# EAGLE schematic Meter Sequencer (EAGLE 9.0.0)
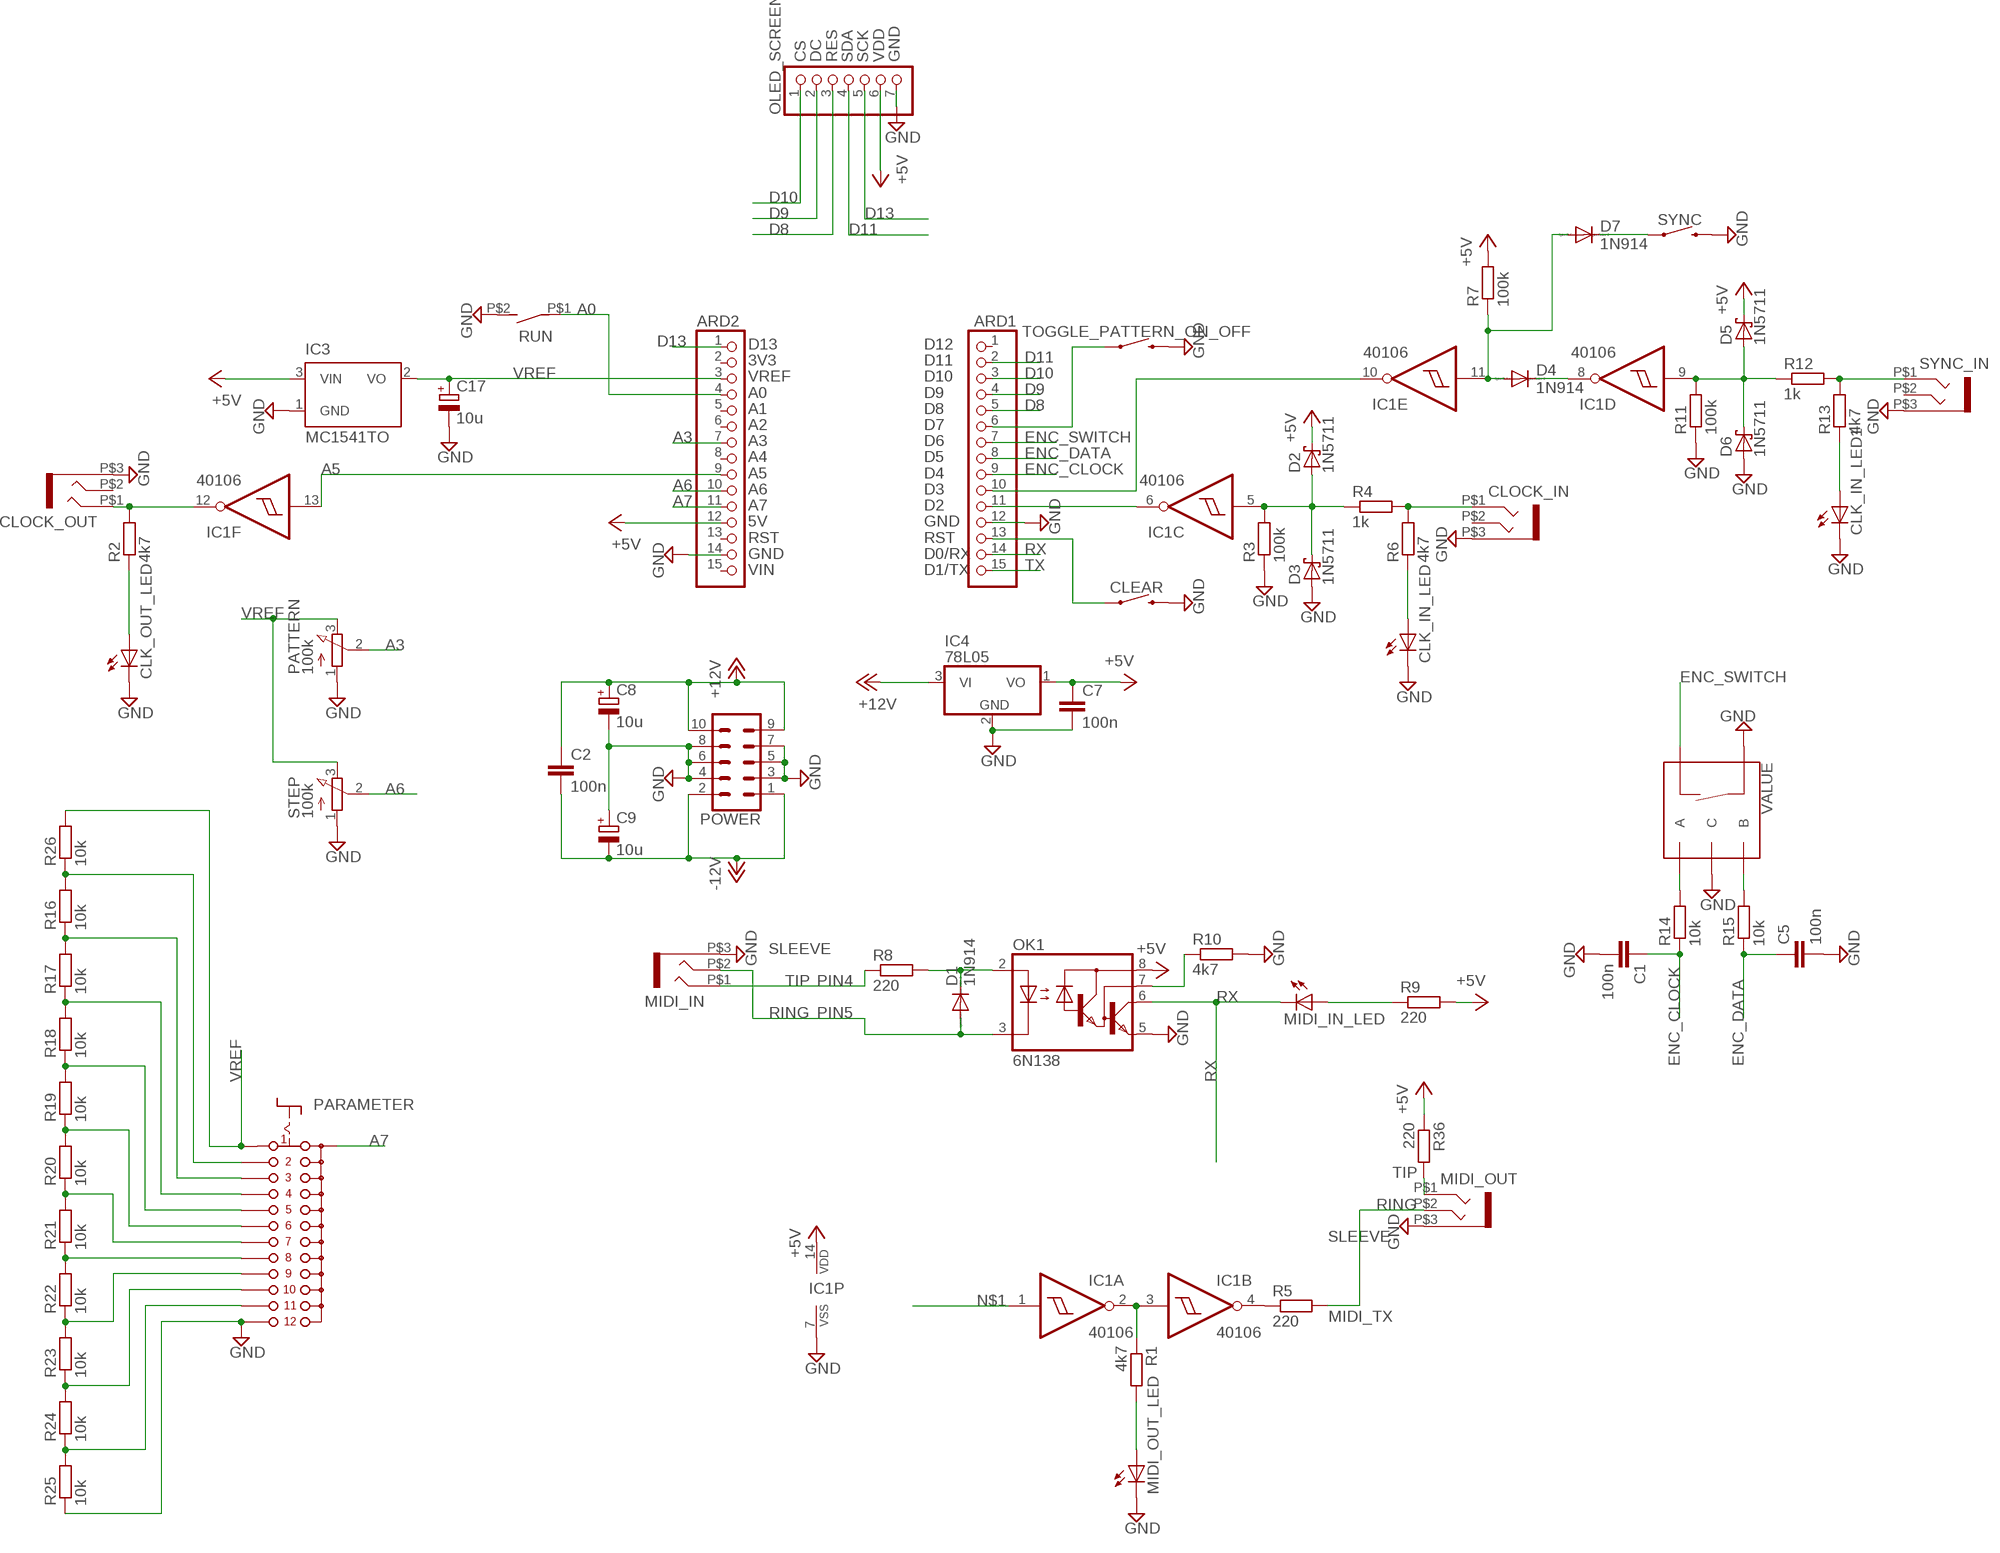
[diagram p0: schematic, sheet 1]

## Parts
ARD1  PINHD-1X15  [1X15]
ARD2  PINHD-1X15  [1X15]
C1  100n  C-EU050-024X044  [C050-024X044]
C2  100n  C-EU050-025X075  [C050-025X075]
C5  100n  C-EU050-024X044  [C050-024X044]
C7  100n  C-EU050-024X044  [C050-024X044]
C8  10u  CPOL-EUE2.5-5  [E2,5-5]
C9  10u  CPOL-EUE2.5-5  [E2,5-5]
C17  10u  CPOL-EUE2.5-5  [E2,5-5]
CLEAR  MOMENTARY-SWITCH-SPST-PTH-6.0MM  [TACTILE_SWITCH_PTH_6.0MM]
CLK_IN_LED  LED3MM-NB  [LED3MM]
CLK_IN_LED1  LED3MM-NB  [LED3MM]
CLK_OUT_LED  LED3MM-NB  [LED3MM]
CLOCK_IN  WQP-PJ301M-STEREO  [WQP-PJ301M-STEREO]
CLOCK_OUT  WQP-PJ301M-STEREO  [WQP-PJ301M-STEREO]
D1  1N914  [D-6.35]
D2  1N5711  1N5817-B  [DO41-7.6]
D3  1N5711  1N5817-B  [DO41-7.6]
D4  1N914  [D-6.35]
D5  1N5711  1N5817-B  [DO41-7.6]
D6  1N5711  1N5817-B  [DO41-7.6]
D7  1N914  [D-6.35]
IC1  40106  40106N  [DIL14]
IC3  MC1541TO  [TO92]
IC4  78L05  78L05Z  [TO92]
MIDI_IN  WQP-PJ301M-STEREO  [WQP-PJ301M-STEREO]
MIDI_IN_LED  LED3MM-NB  [LED3MM]
MIDI_OUT  WQP-PJ301M-STEREO  [WQP-PJ301M-STEREO]
MIDI_OUT_LED  LED3MM-NB  [LED3MM]
OK1  6N138  [DIL08]
OLED_SCREEN  PINHD-1X7  [1X07]
PARAMETER  CK101X12  [CK101X12]
PATTERN  100k  3RP/1610N  [3RP/1610N]
POWER  CONN_05X2SHD  [2X5-SHROUDED]
R1  4k7  BOX-RESISTOR  [0204/7]
R2  4k7  BOX-RESISTOR  [0204/7]
R3  100k  BOX-RESISTOR  [0204/7]
R4  1k  BOX-RESISTOR  [0204/7]
R5  220  BOX-RESISTOR  [0204/7]
R6  4k7  BOX-RESISTOR  [0204/7]
R7  100k  BOX-RESISTOR  [0204/7]
R8  220  BOX-RESISTOR  [0204/7]
R9  220  BOX-RESISTOR  [0204/7]
R10  4k7  BOX-RESISTOR  [0204/7]
R11  100k  BOX-RESISTOR  [0204/7]
R12  1k  BOX-RESISTOR  [0204/7]
R13  4k7  BOX-RESISTOR  [0204/7]
R14  10k  R-EU_0204/7  [0204/7]
R15  10k  R-EU_0204/7  [0204/7]
R16  10k  BOX-RESISTOR  [0204/7]
R17  10k  BOX-RESISTOR  [0204/7]
R18  10k  BOX-RESISTOR  [0204/7]
R19  10k  BOX-RESISTOR  [0204/7]
R20  10k  BOX-RESISTOR  [0204/7]
R21  10k  BOX-RESISTOR  [0204/7]
R22  10k  BOX-RESISTOR  [0204/7]
R23  10k  BOX-RESISTOR  [0204/7]
R24  10k  BOX-RESISTOR  [0204/7]
R25  10k  BOX-RESISTOR  [0204/7]
R26  10k  BOX-RESISTOR  [0204/7]
R36  220  BOX-RESISTOR  [0204/7]
RUN  TOGGLE-NB  [TOGGLE-NB]
STEP  100k  3RP/1610N  [3RP/1610N]
SYNC  MOMENTARY-SWITCH-SPST-PTH-6.0MM  [TACTILE_SWITCH_PTH_6.0MM]
SYNC_IN  WQP-PJ301M-STEREO  [WQP-PJ301M-STEREO]
TOGGLE_PATTERN_ON_OFF  MOMENTARY-SWITCH-SPST-PTH-6.0MM  [TACTILE_SWITCH_PTH_6.0MM]
VALUE  ROTARY_ENCODER  [ROTARY_ENC_PLAIN]

## Nets
+5V [power]: ARD2.12 C7.1 D2.C D5.C IC1.14(P:VDD) IC3.3(VIN) IC4.1(VO) OK1.8(VCC) OLED_SCREEN.6 R7.2 R9.2 R36.1
+12V [power]: C2.1 C8.+ IC4.3(VI) POWER.9 POWER.10
-12V: C2.2 C9.- POWER.1 POWER.2
A0: ARD2.4 RUN.P$1(P)
A3: ARD2.7 PATTERN.2(S)
A5: ARD2.9 IC1.13(F:I)
A6: ARD2.10 STEP.2(S)
A7: ARD2.11 PARAMETER.A
D8: ARD1.5 OLED_SCREEN.3
D9: ARD1.4 OLED_SCREEN.2
D10: ARD1.3 OLED_SCREEN.1
D11: ARD1.2 OLED_SCREEN.4
D13: ARD2.1 OLED_SCREEN.5
ENC_CLOCK: ARD1.9 C1.1 R14.1
ENC_DATA: ARD1.8 C5.1 R15.1
ENC_SWITCH: ARD1.7 VALUE.SW-
GND: ARD1.12 ARD2.14 C1.2 C5.2 C7.2 C9.+ C17.- CLEAR.3 CLK_IN_LED1.K(C) CLK_IN_LED.K(C) CLK_OUT_LED.K(C) CLOCK_IN.P$3 CLOCK_OUT.P$3 D3.A D6.A IC1.7(P:VSS) IC3.1(GND) IC4.2(GND) MIDI_IN.P$3 MIDI_OUT.P$3 MIDI_OUT_LED.K(C) OK1.5(GND) OLED_SCREEN.7 PARAMETER.12 PATTERN.1(A) POWER.3 POWER.4 POWER.5 POWER.6 POWER.7 POWER.8 R3.1 R10.2 R11.1 R25.1 RUN.P$2(S) STEP.1(A) SYNC.3 SYNC_IN.P$3 TOGGLE_PATTERN_ON_OFF.3 VALUE.C VALUE.SW+
MIDI_TX: MIDI_OUT.P$2 R5.2
N$1: IC1.1(A:I)
N$2: MIDI_OUT_LED.A R1.2
N$3: CLOCK_OUT.P$1 IC1.12(F:O) R2.2
N$4: CLK_OUT_LED.A R2.1
N$5: ARD1.11 IC1.6(C:O)
N$6: D2.A D3.C IC1.5(C:I) R3.2 R4.1
N$7: CLOCK_IN.P$1 R4.2 R6.2
N$8: CLK_IN_LED.A R6.1
N$9: D4.A D7.A IC1.11(E:I) R7.1
N$10: D4.C IC1.8(D:O)
N$11: D5.A D6.C IC1.9(D:I) R11.2 R12.1
N$12: ARD1.10 IC1.10(E:O)
N$13: R12.2 R13.2 SYNC_IN.P$1
N$14: CLK_IN_LED1.A R13.1
N$15: D7.C SYNC.1
N$16: MIDI_IN_LED.A R9.1
N$17: R14.2 VALUE.A
N$18: R15.2 VALUE.B
N$19: ARD1.13 CLEAR.1
N$20: ARD1.6 TOGGLE_PATTERN_ON_OFF.1
N$21: PARAMETER.3 R16.1 R17.2
N$22: PARAMETER.4 R17.1 R18.2
N$23: PARAMETER.5 R18.1 R19.2
N$24: PARAMETER.6 R19.1 R20.2
N$25: PARAMETER.7 R20.1 R21.2
N$26: PARAMETER.8 R21.1 R22.2
N$27: PARAMETER.9 R22.1 R23.2
N$28: PARAMETER.10 R23.1 R24.2
N$29: PARAMETER.11 R24.1 R25.2
N$31: PARAMETER.2 R16.2 R26.1
N$43: IC1.2(A:O) IC1.3(B:I) R1.1
N$44: IC1.4(B:O) R5.1
N$45: MIDI_OUT.P$1 R36.2
N$52: OK1.7(VB) R10.1
N$53: D1.C OK1.2(A) R8.2
PIN4: MIDI_IN.P$1 R8.1
PIN5: D1.A MIDI_IN.P$2 OK1.3(C)
RX: ARD1.14 MIDI_IN_LED.K(C) OK1.6(VO)
TX: ARD1.15
VREF: ARD2.3 C17.+ IC3.2(VO) PARAMETER.1 PATTERN.3(E) R26.2 STEP.3(E)
Unconnected: ARD1.1 ARD2.2 ARD2.5 ARD2.6 ARD2.8 ARD2.13 ARD2.15 C8.- CLOCK_IN.P$2 CLOCK_OUT.P$2 SYNC_IN.P$2

## Notes on the sheet
- CS
  DC
  RES
  SDA
  SCK
  VDD
  GND
- D13
  3V3
  VREF
  A0
  A1
  A2
  A3
  A4
  A5
  A6
  A7
  5V
  RST
  GND
  VIN
- D12
  D11
  D10
  D9
  D8
  D7
  D6
  D5
  D4
  D3
  D2
  GND
  RST
  D0/RX
  D1/TX
- SLEEVE
- TIP
- RING
- TIP
- RING
- SLEEVE

## Library data of the parts
ARD1 ARD2 = pinhead:PINHD-1X15: PIN HEADER
C1 C2 C5 C7 = rcl:C-EU: CAPACITOR, European symbol; SPICEPREFIX: C
C8 C9 C17 = rcl:CPOL-EU: POLARIZED CAPACITOR, European symbol; SPICEPREFIX: C
CLEAR SYNC TOGGLE_PATTERN_ON_OFF = SparkFun-Switches:MOMENTARY-SWITCH-SPST: Momentary Switch (Pushbutton) - SPST Normally-open (NO) SPST momentary switches (buttons, pushbuttons). Variants PTH-12MM - 12mm square, through-hole Momentary Pushbutton Switch - 12mm Square <https://www.sparkfun.com/products/9190> (COM-09190) PTH-6.0MM, PTH-6.0MM-KIT - 6.0mm square, through-hole Mini Pushbutton Switch <https://www.sparkfun.com/products/97> (COM-00097) KIT package intended for soldering kit's - only one side of pads' copper is exposed. PTH-RIGHT-ANGLE-KIT - Right-angle, through-hole Right Angle Tactile Button <https://www.sparkfun.com/products/10791> - Used on SparkFun BigTime Watch Kit <https://www.sparkfun.com/products/11734> SMD-12MM - 12mm square, surface-mount Tactile Button - SMD (12mm) <https://www.sparkfun.com/products/12993> (COM-12993) Used on SparkFun PicoBoard <https://www.sparkfun.com/products/11888> SMD-4.5MM - 4.5mm Square Trackball Switch Used on SparkFun Blackberry Trackballer Breakout <https://www.sparkfun.com/products/13169> SMD-4.6MMX2.8MM - 4.60mm x 2.80mm, surface mount Used on SparkFun SAMD21 Mini Breakout <https://www.sparkfun.com/products/13664> SMD-5.2MM, SMD-5.2-REDUNDANT - 5.2mm square, surface-mount Mini Pushbutton Switch - SMD <https://www.sparkfun.com/products/8720> (COM-08720) Used on Arduino Pro Mini <https://www.sparkfun.com/products/11114> REDUNDANT package connects both switch circuits together SMD-6.0X3.5MM - 6.0 x 3.5mm, surface mount Momentary Reset Switch SMD <https://www.sparkfun.com/products/8229> (COM-08229) SMD-6.2MM-TALL - 6.2mm square, surface mount Tactile Button - SMD (6mm) <https://www.sparkfun.com/products/12992> Used on SparkFun Digital Sandbox <https://www.sparkfun.com/products/12651> SMD-RIGHT-ANGLE - Right-angle, surface mount Used on SparkFun Block for Intel® Edison - Arduino <https://www.sparkfun.com/products/13036>; PROD_ID: SWCH-08441; SF_SKU: COM-00097
CLK_IN_LED CLK_IN_LED1 CLK_OUT_LED MIDI_IN_LED MIDI_OUT_LED = toggle-nb:LED3MM-NB
CLOCK_IN CLOCK_OUT MIDI_IN MIDI_OUT SYNC_IN = thonkiconn:WQP-PJ301M-STEREO
D1 D4 D7 = toggle-nb:1N914
D2 D3 D5 D6 = diode:1N581*: 1.0A SCHOTTKY BARRIER RECTIFIER Source: http://www.diodes.com/datasheets/ds23001.pdf
IC1 = 40xx:40106: Hex SCHMITT TRIGGER
IC3 = microchip:MC15*: 2.5V and 4.096V Voltage References Source: http://www.microchip.com .. 21653b.pdf; OC_FARNELL: unknown; OC_NEWARK: unknown
IC4 = linear:78*: Positive VOLTAGE REGULATOR Source: http://cache.national.com/ds/LM/LM78L05.pdf http://www.fairchildsemi.com/ds/LM/LM7805.pdf
OK1 = optocoupler:6N138: MOTOROLA OPTO COUPLER; MF: VISHAY/TELEFUNKEN; MPN: 6N138; OC_FARNELL: 9860150; OC_NEWARK: 35K5294
OLED_SCREEN = pinhead:PINHD-1X7: PIN HEADER
PARAMETER = switch:CK101X12: ROTARY SWITCH C&K
PATTERN STEP = pot:3RP/1610N: 16mm Potentiometer one level Source: http://www.alphapotentiometers.net/html/16mm_pot_2.html
POWER = SparkFun-Connectors:CONN_05X2: Multi connection point. Often used as Generic Header-pin footprint for 0.1 inch spaced/style header connections For AVR SPI programming port, see special device with nice symbol: "AVR_SPI_PROG_5x2.dev" You can populate with any combo of single row headers, but if you'd like an exact match, check these: 2x5 AVR ICSP Male Header <https://www.sparkfun.com/products/778> (PRT-00778) 2x5 Pin Shrouded Header <https://www.sparkfun.com/products/8506> (PRT-08506) On any of the 0.1 inch spaced packages, you can populate with these: Break Away Headers - Straight <https://www.sparkfun.com/products/116> (PRT-00116) Break Away Male Headers - Right Angle <https://www.sparkfun.com/products/553> (PRT-00553) Female Headers <https://www.sparkfun.com/products/115> (PRT-00115) Break Away Headers - Machine Pin <https://www.sparkfun.com/products/117> (PRT-00117) Break Away Female Headers - Swiss Machine Pin <https://www.sparkfun.com/products/743> (PRT-00743) Special note: the shrouded connector mates well with our 5x2 ribbon cables: 2x5 Pin IDC Ribbon Cable <https://www.sparkfun.com/products/8535> (PRT-08535); PROD_ID: CONN-08671; SF_ID: PRT-08506
R1-R13 R16-R26 R36 = toggle-nb:BOX-RESISTOR
R14 R15 = rcl:R-EU_: RESISTOR, European symbol; SPICEPREFIX: R
RUN = toggle-nb:TOGGLE-NB
VALUE = toggle-nb:ROTARY_ENCODER

## Net classes
0 default: width 0.559 mm, clearance 0.203 mm
1 power: width 0.559 mm, clearance 0.152 mm